# Altium schematic sheet V0.0.SchDoc
size A4
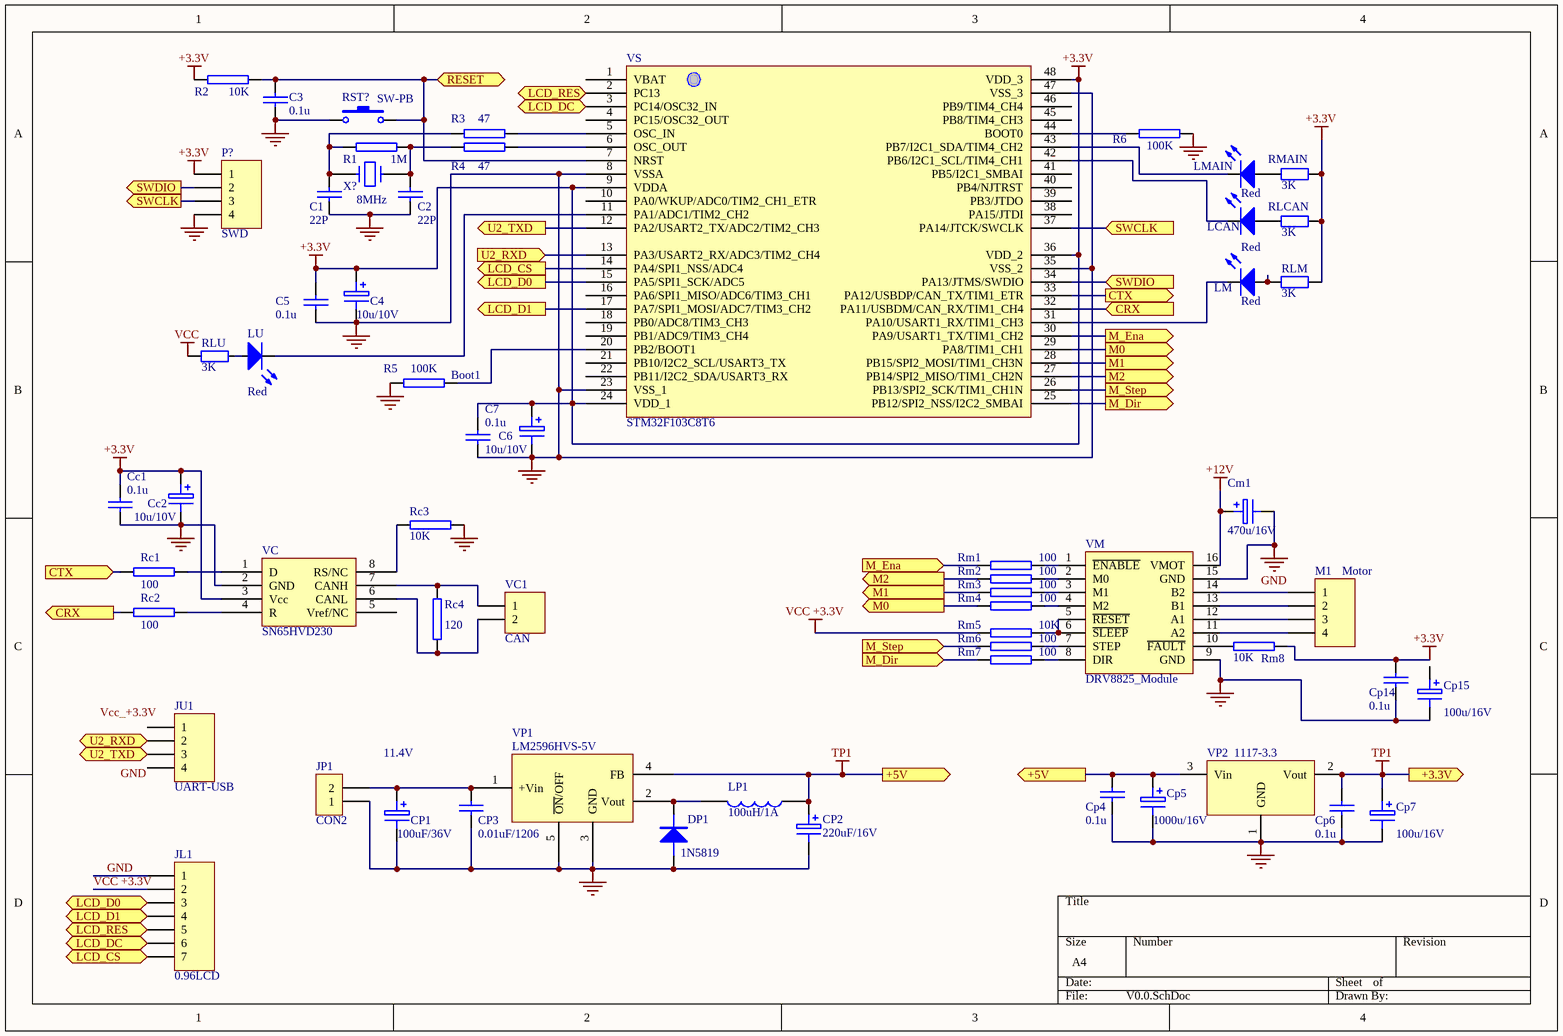
[diagram p0: V0.0.SchDoc]

## Parts
C1  22P
C2  22P
C3  0.1u
C4  10u/10V
C5  0.1u
C6  10u/10V
C7  0.1u
Cc1  0.1u
Cc2  10u/10V
Cm1  470u/16V
CP1  100uF/36V
CP2  220uF/16V
CP3  0.01uF/1206
Cp4  0.1u
Cp5  1000u/16V
Cp6  0.1u
Cp7  100u/16V
Cp14  0.1u
Cp15  100u/16V
DP1  1N5819
JL1  0.96LCD  [HDR1X7]
JP1  CON2
JU1  UART-USB  [HDR1X4]
LCAN  Red  [LED-0]
LM  Red  [LED-0]
LMAIN  Red  [LED-0]
LP1  100uH/1A
LU  Red  [LED-0]
M1  Motor  [HDR1X4]
P?  SWD  [HDR1X4]
R1  1M
R2  10K
R3  47
R4  47
R5  100K
R6  100K
Rc1  100
Rc2  100
Rc3  10K
Rc4  120
RLCAN  value 3K  [AXIAL-0.4]  (hidden comment: Res2)
RLM  value 3K  [AXIAL-0.4]  (hidden comment: Res2)
RLU  value 3K  [AXIAL-0.4]  (hidden comment: Res2)
Rm1  100
Rm2  100
Rm3  100
Rm4  100
Rm5  10K
Rm6  100
Rm7  100
Rm8  10K
RMAIN  value 3K  [AXIAL-0.4]  (hidden comment: Res2)
RST?  SW-PB  [SPST-2]
VC  SN65HVD230
VC1  CAN  [HDR1X2]
VM  DRV8825_Module
VP1  LM2596HVS-5V
VP2  1117-3.3
VS  STM32F103C8T6
X?  8MHz

## Ports
+3.3V, +5V (out), CRX (in), CRX (out), CTX (in), CTX (out), LCD_CS (in), LCD_CS (out), LCD_D0 (in), LCD_D0 (out), LCD_D1 (in), LCD_D1 (out), LCD_DC (in), LCD_DC (out), LCD_RES (in), LCD_RES (out), M0 (out), M1 (out), M2 (out), M_Dir (in), M_Dir (out), M_Ena (in), M_Ena (out), M_Step (in), M_Step (out), RESET, SWCLK (in), SWCLK (out), SWDIO (in), SWDIO (out), U2_RXD (in), U2_RXD (out), U2_TXD (in), U2_TXD (out)

## Nets
+3.3V: C4.1 C5.1 C6.1 C7.1 Cc1.1 Cc2.1 Cp14.1 P?.1 R2.2 RLCAN.1 RLM.1 Rm8.1 RMAIN.1 VC.3(Vcc) VS.9(VDDA) VS.24(VDD_1) VS.36(VDD_2) VS.48(VDD_3)
+12V: Cm1.1 VM.16(VMOT)
GND: C1.1 C2.1 C3.1 C4.2 C5.2 C6.2 C7.2 Cc1.2 Cc2.2 Cm1.2 Cp4.2 Cp5.2 Cp6.2 Cp7.2 JL1.1 P?.4 R5.2 R6.1 Rc3.2 RST?.1 VC.2(GND) VM.15(GND) VP2.1(GND) VS.8(VSSA) VS.23(VSS_1) VS.35(VSS_2) VS.47(VSS_3)
NetCp14_2: Cp14.2 Cp15.2 VM.9(GND)
TP1: CP2.1 Cp4.1 Cp5.1 Cp6.1 Cp7.1 LP1.1 VP1.4(FB) VP2.2(Vout) VP2.3(Vin) ; port +3.3V, port +5V
VCC: CP1.2 CP2.2 CP3.2 DP1.1(A) JP1.1 RLU.2 VP1.3(GND) VP1.5(~{ON}/OFF)
VCC +3.3V: JL1.2 Rm5.1
CRX: Rc2.1 VS.32(PA11/USBDM/CAN_RX/TIM1_CH4) ; port CRX
CTX: Rc1.1 VS.33(PA12/USBDP/CAN_TX/TIM1_ETR) ; port CTX
LCD_CS: JL1.7 VS.14(PA4/SPI1_NSS/ADC4) ; port LCD_CS
LCD_D0: JL1.3 VS.15(PA5/SPI1_SCK/ADC5) ; port LCD_D0
LCD_D1: JL1.4 VS.17(PA7/SPI1_MOSI/ADC7/TIM3_CH2) ; port LCD_D1
LCD_DC: JL1.6 VS.3(PC14/OSC32_IN) ; port LCD_DC
LCD_RES: JL1.5 VS.2(PC13) ; port LCD_RES
M0: Rm4.1 VS.29(PA8/TIM1_CH1) ; port M0
M1: Rm3.1 VS.28(PB15/SPI2_MOSI/TIM1_CH3N) ; port M1
M2: Rm2.1 VS.27(PB14/SPI2_MISO/TIM1_CH2N) ; port M2
M_Dir: Rm7.1 VS.25(PB12/SPI2_NSS/I2C2_SMBAI) ; port M_Dir
M_Ena: Rm1.1 VS.30(PA9/USART1_TX/TIM1_CH2) ; port M_Ena
M_Step: Rm6.1 VS.26(PB13/SPI2_SCK/TIM1_CH1N) ; port M_Step
RESET: C3.2 R2.1 RST?.2 VS.7(NRST) ; port RESET
SWCLK: P?.3 VS.37(PA14/JTCK/SWCLK) ; port SWCLK
SWDIO: P?.2 VS.34(PA13/JTMS/SWDIO) ; port SWDIO
U2_RXD: JU1.2 VS.13(PA3/USART2_RX/ADC3/TIM2_CH4) ; port U2_RXD
U2_TXD: JU1.3 VS.12(PA2/USART2_TX/ADC2/TIM2_CH3) ; port U2_TXD
NetC1_2: C1.2 R1.2 R3.2 X?.1
NetC2_2: C2.2 R1.1 R4.2 X?.2
NetCP1_1: CP1.1 CP3.1 JP1.2 VP1.1(+Vin)
NetDP1_2: DP1.2(K) LP1.2 VP1.2(Vout)
NetLCAN_1: LCAN.1(A) RLCAN.2
NetLCAN_2: LCAN.2(K) VS.42(PB6/I2C1_SCL/TIM4_CH1)
NetLM_1: LM.1(A) RLM.2
NetLM_2: LM.2(K) VS.31(PA10/USART1_RX/TIM1_CH3)
NetLMAIN_1: LMAIN.1(A) RMAIN.2
NetLMAIN_2: LMAIN.2(K) VS.43(PB7/I2C1_SDA/TIM4_CH2)
NetLU_1: LU.1(A) RLU.1
NetLU_2: LU.2(K) VS.11(PA1/ADC1/TIM2_CH2)
NetM1_1: M1.1 VM.14(B2)
NetM1_2: M1.2 VM.13(B1)
NetM1_3: M1.3 VM.12(A1)
NetM1_4: M1.4 VM.11(A2)
NetR3_1: R3.1 VS.5(OSC_IN)
NetR4_1: R4.1 VS.6(OSC_OUT)
NetR5_1: R5.1 VS.20(PB2/BOOT1)
NetR6_2: R6.2 VS.44(BOOT0)
NetRc1_2: Rc1.2 VC.1(D)
NetRc2_2: Rc2.2 VC.4(R)
NetRc3_1: Rc3.1 VC.8(RS/NC)
NetRc4_1: Rc4.1 VC.7(CANH) VC1.1
NetRc4_2: Rc4.2 VC.6(CANL) VC1.2
NetRm1_2: Rm1.2 VM.1(~{ENABLE})
NetRm2_2: Rm2.2 VM.2(M0)
NetRm3_2: Rm3.2 VM.3(M1)
NetRm4_2: Rm4.2 VM.4(M2)
NetRm5_2: Rm5.2 VM.5(~{RESET}) VM.6(~{SLEEP})
NetRm6_2: Rm6.2 VM.7(STEP)
NetRm7_2: Rm7.2 VM.8(DIR)
NetRm8_2: Rm8.2 VM.10(~{FAULT})

Not connected (* = marked no-connect by the designer): Cp15 1; JU1 1 4; VC 5(Vref/NC); VS 1(VBAT) 4(PC15/OSC32_OUT) 10(PA0/WKUP/ADC0/TIM2_CH1_ETR) 16(PA6/SPI1_MISO/ADC6/TIM3_CH1) 18(PB0/ADC8/TIM3_CH3) 19(PB1/ADC9/TIM3_CH4) 21(PB10/I2C2_SCL/USART3_TX) 22(PB11/I2C2_SDA/USART3_RX) 38(PA15/JTDI) 39(PB3/JTDO) 40(PB4/NJTRST) 41(PB5/I2C1_SMBAI) 45(PB8/TIM4_CH3) 46(PB9/TIM4_CH4)

## Notes on the sheet
- (near R5) Boot1
- 11.4V
- Labels drawn without touching a wire or pin: GND, Vcc_+3.3V

## Library data of the parts
C1-C3 C5 C7 Cc1 CP3 Cp4 Cp6 Cp14 = CAP: Capacitor
C4 C6 Cc2 Cm1 CP1 CP2 Cp5 Cp7 Cp15 = ELECTRO1: Electrolytic Capacitor
DP1 = DIODE
JL1 = Header 7: Header, 7-Pin; LatestRevisionDate: 17-Jul-2002; LatestRevisionNote: Re-released for DXP Platform.; Publisher: Altium Limited
JP1 = CON2: Connector
JU1 M1 P? = Header 4: Header, 4-Pin; LatestRevisionDate: 17-Jul-2002; LatestRevisionNote: Re-released for DXP Platform.; Publisher: Altium Limited
LCAN LM LMAIN LU = LED0: Typical INFRARED GaAs LED; Published: 8-Jun-2000; LatestRevisionDate: 08-Jul-2005; LatestRevisionNote: Mech Layer 1 removed.; PackageReference: LED-0; Publisher: Altium Limited
LP1 = INDUCTOR1
R1-R6 Rc1-Rc4 Rm1-Rm8 = RES2
RLCAN RLM RLU RMAIN = Res2: Resistor; Published: 8-Jun-2000; LatestRevisionDate: 17-Jul-2002; LatestRevisionNote: Re-released for DXP Platform.; PackageReference: AXIAL-0.4; Publisher: Altium Limited
RST? = SW-PB: Switch; Published: 24-Mar-1999; LatestRevisionDate: 17-Jul-2002; LatestRevisionNote: Re-released for DXP Platform.; PackageReference: SPST-2; Publisher: Altium Limited
VC1 = Header 2: Header, 2-Pin; LatestRevisionDate: 17-Jul-2002; LatestRevisionNote: Re-released for DXP Platform.; Publisher: Altium Limited
X? = CRYSTAL